# EasyEDA Pro project MN42_v2.eprj, board btnBRD
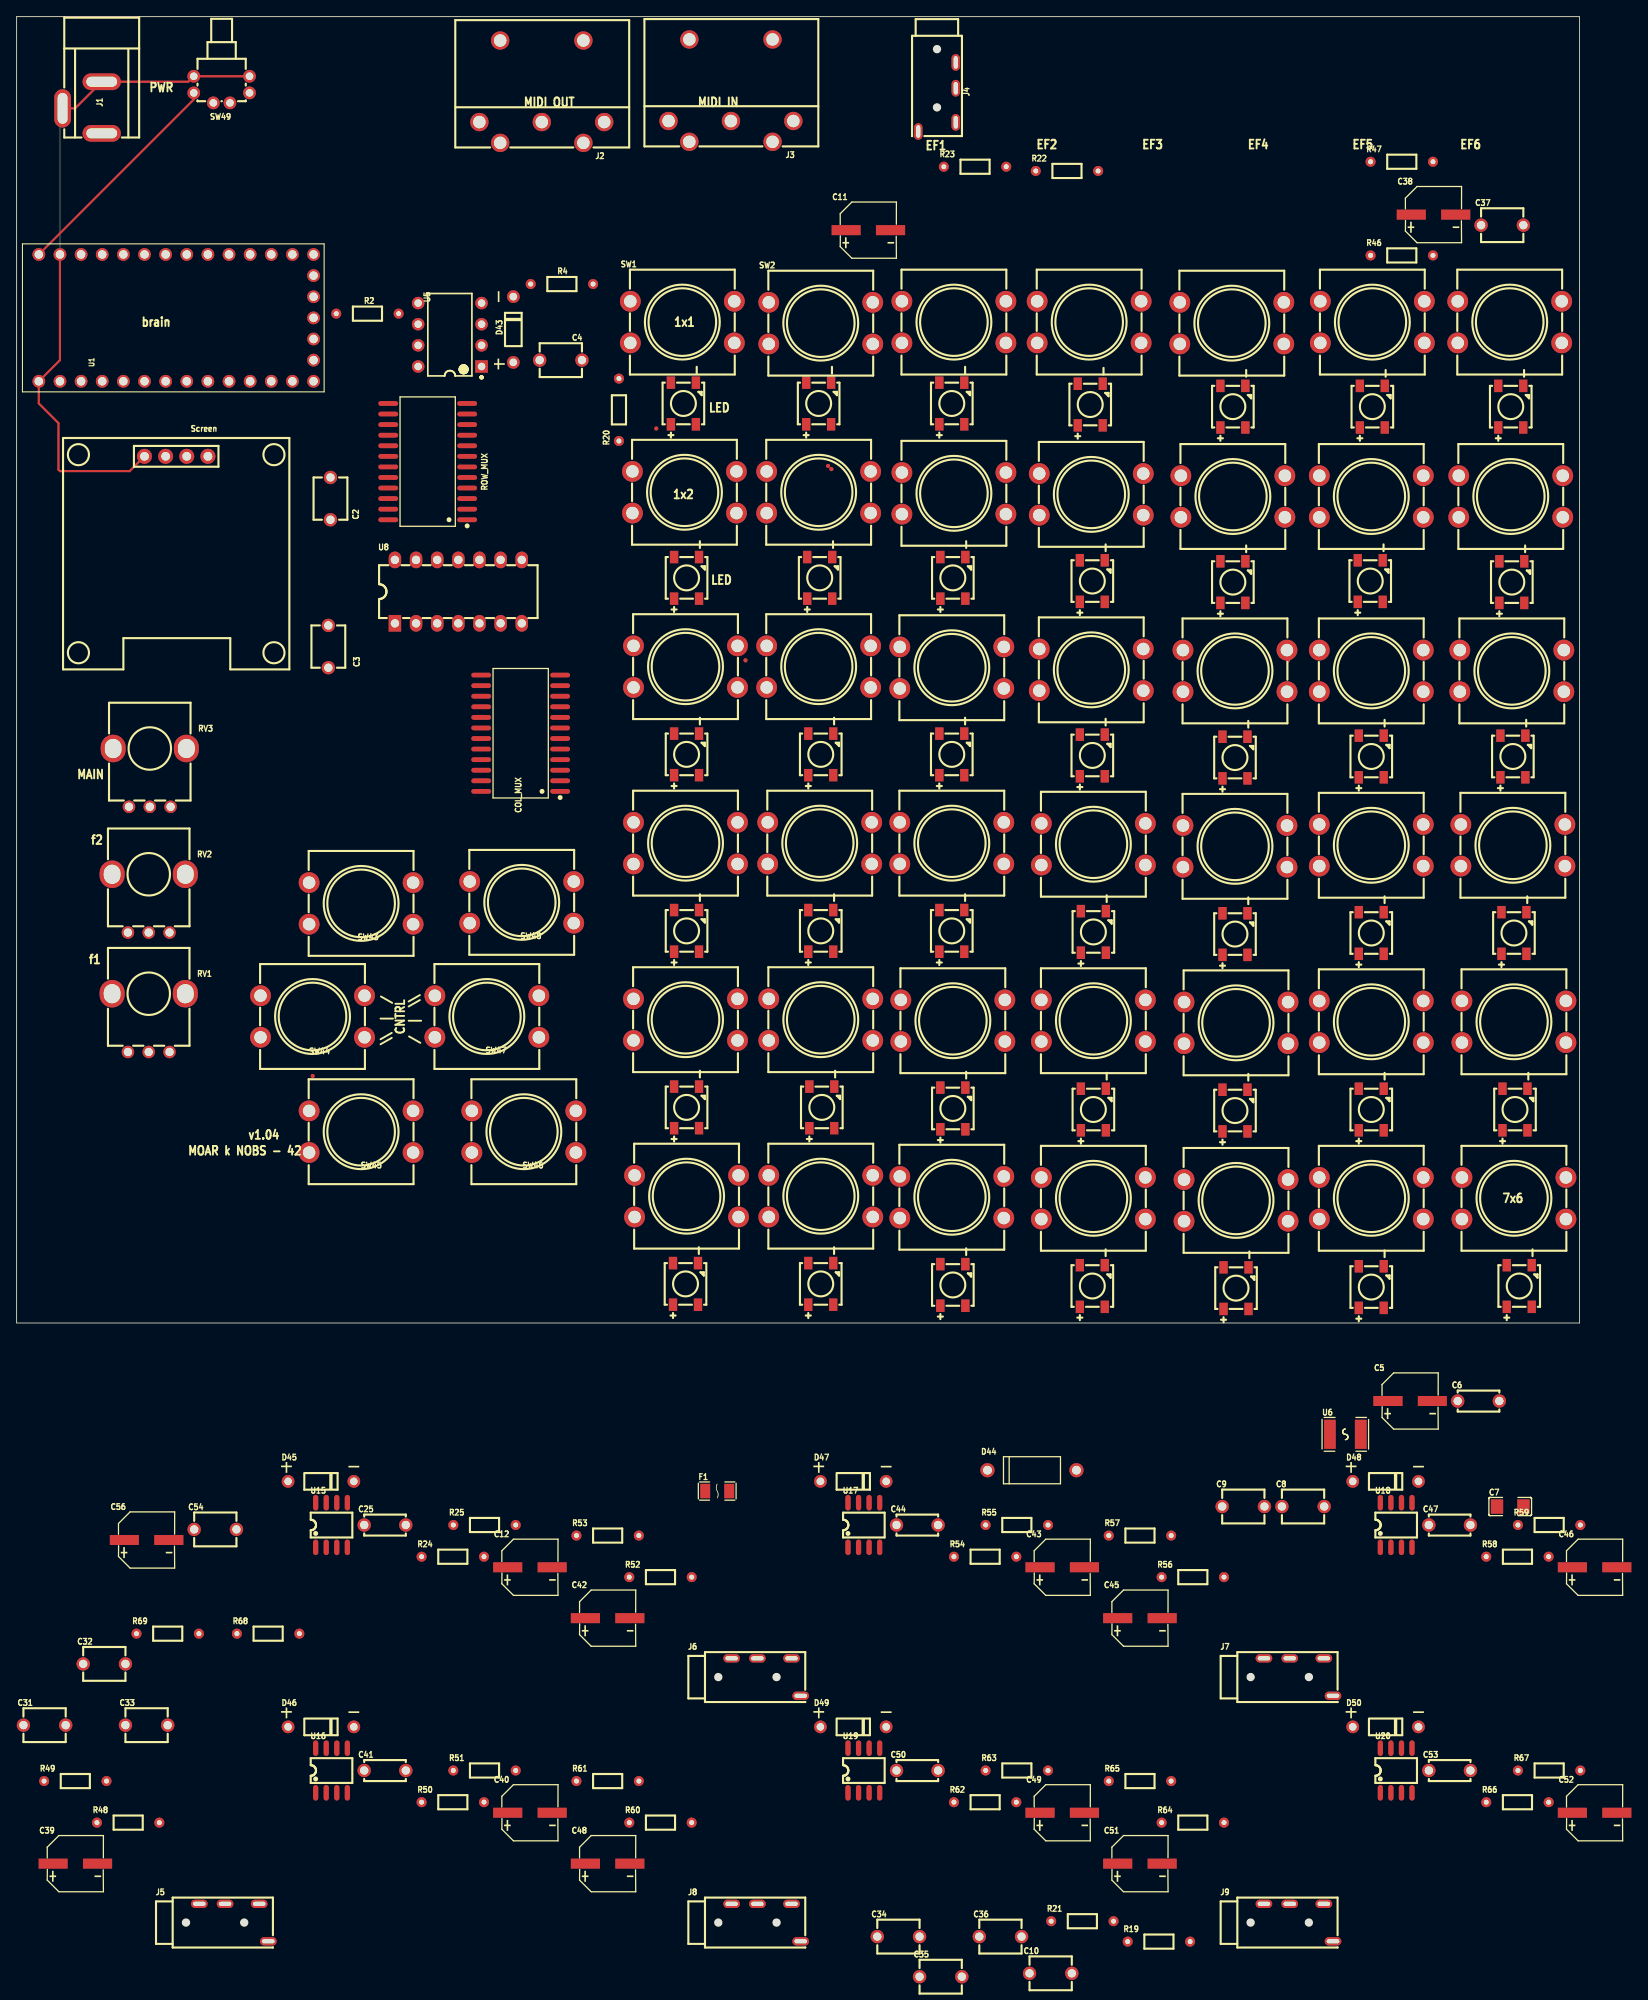
[diagram p3: board, top side]
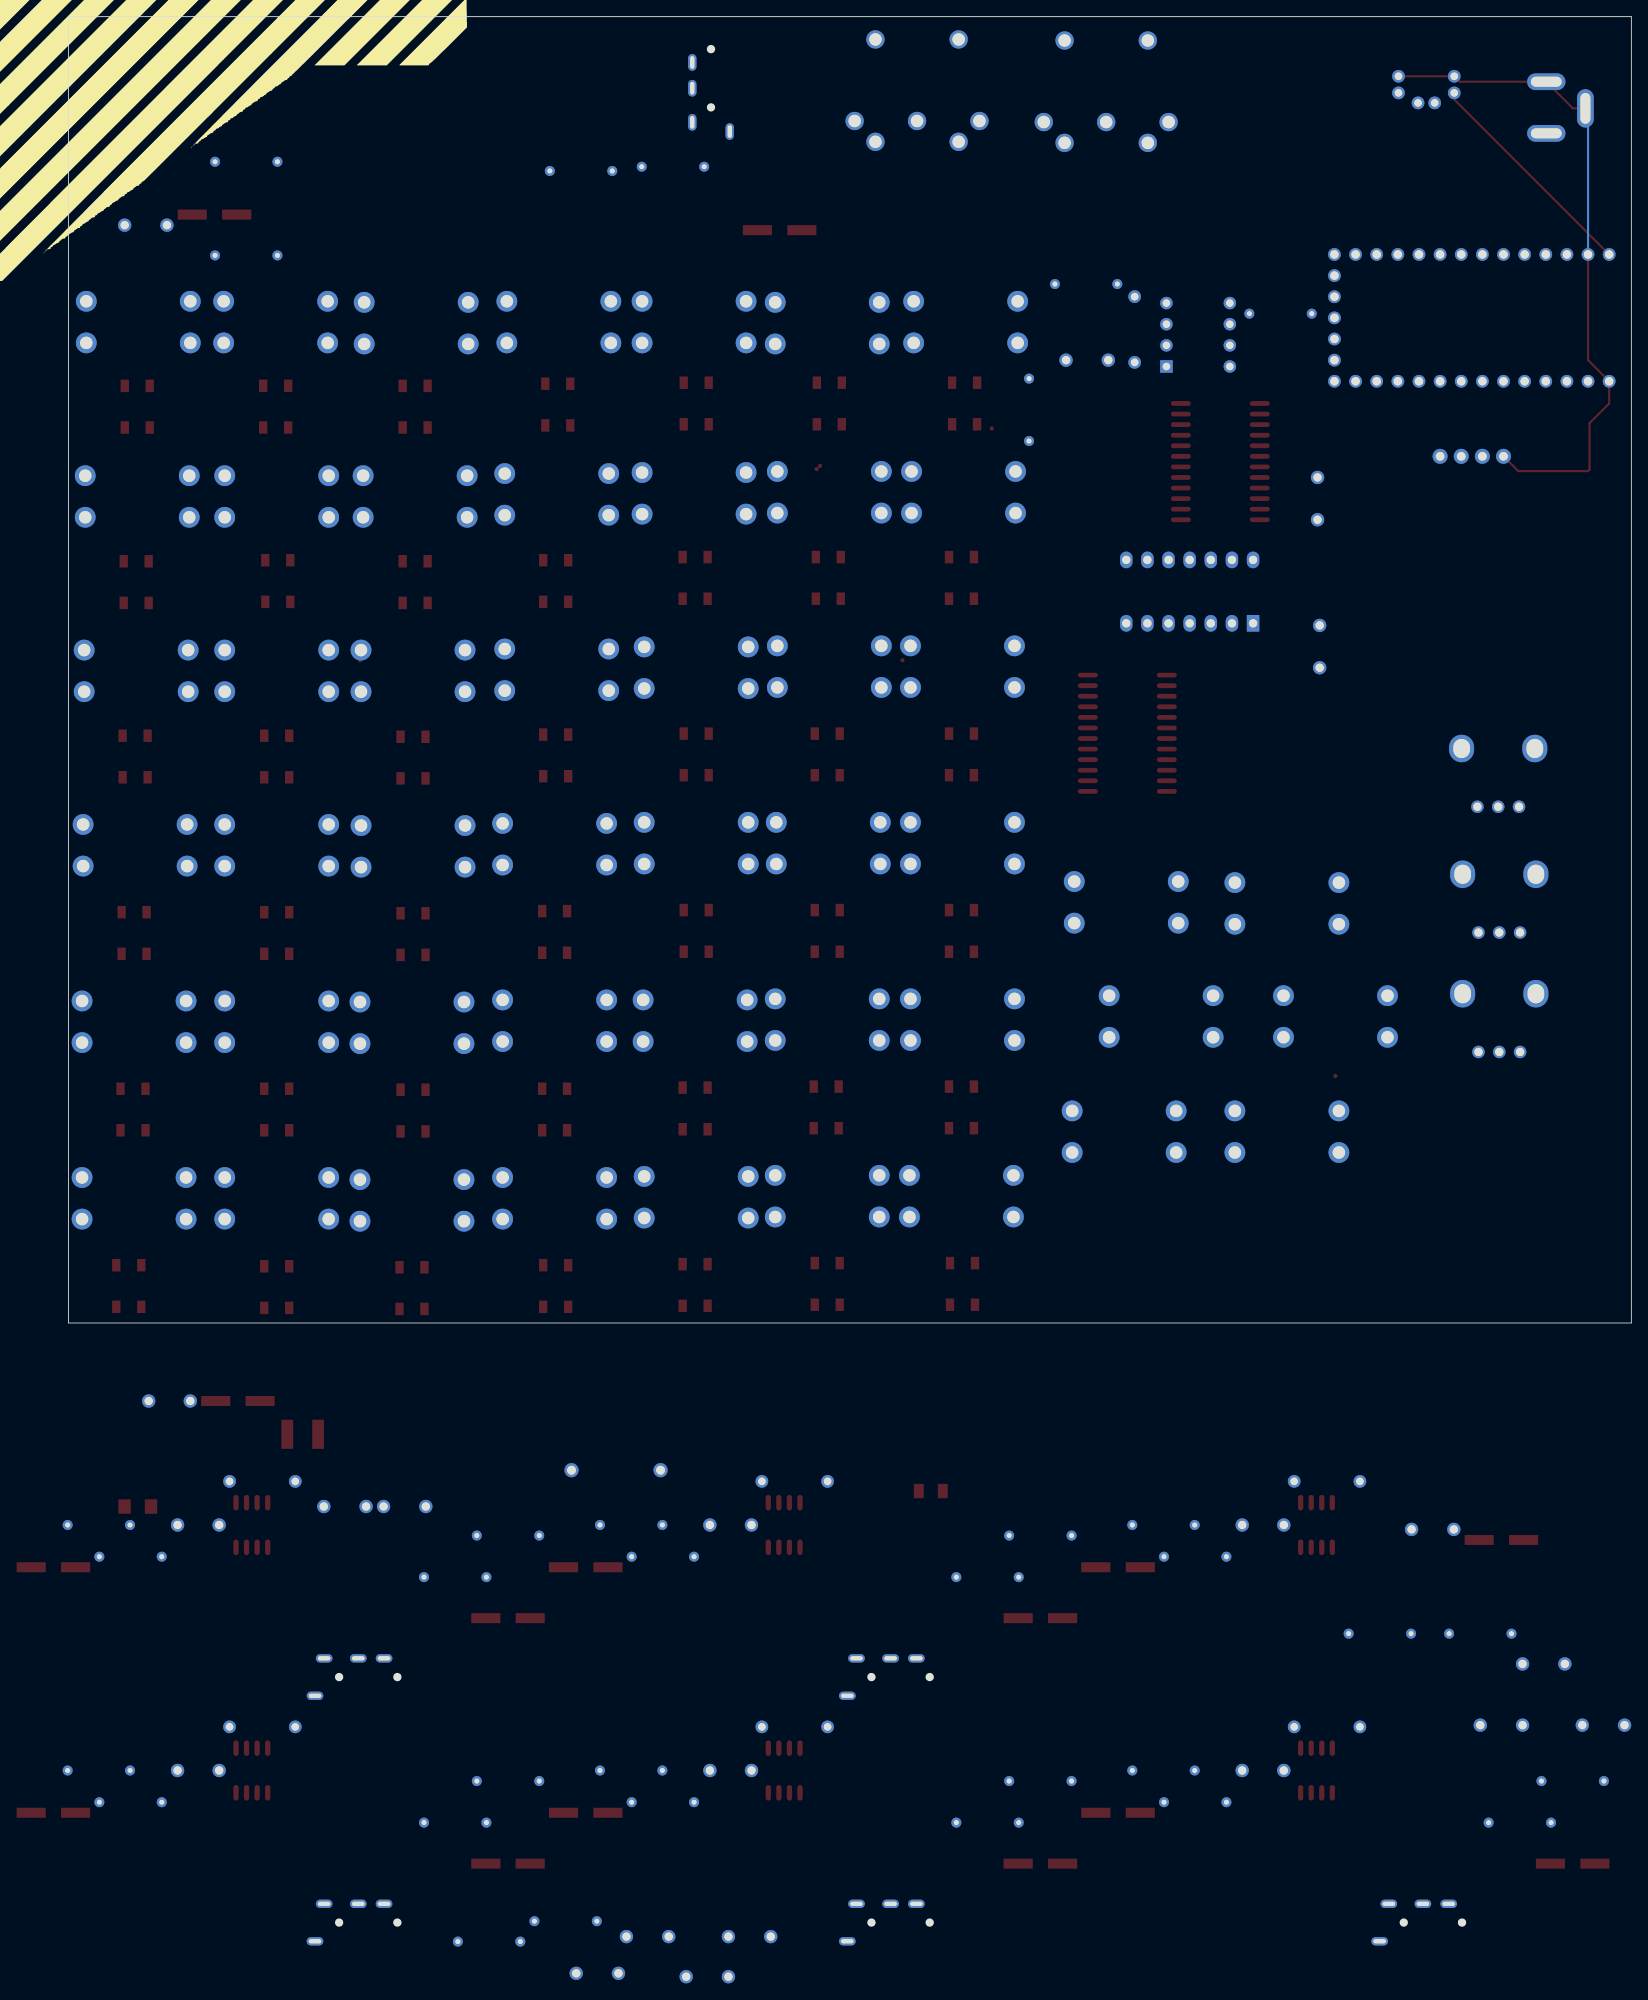
[diagram p4: board, bottom side, seen from below]

Outline 187.83 x 229.51 mm; copper layers: Top Layer, Bottom Layer. Coordinates in mm from the lower left corner of the outline.
Outline path: 0,229.51 0,72.54 187.83,72.54 187.83,229.51 0,229.51
Stack: Top Layer 0.035mm / Dielectric1 1.51mm FR4 er 4.5 / Bottom Layer 0.035mm

## Design rules (mm)
spacing safeClearance (default): track to track 0.152, other pairs 0.152 to 0.3
track width trackWidth (default): min 0.127, default 0.254, max 2.54
differential pair differentialPair (default): width min 0.127, default 0.254, max 2.54; gap min 0.152, default 0.152
via viaSize (default): diameter min 0.5, default 0.61, max 10; hole min 0.3, default 0.305, max 6

## Placement (name value [footprint] x y rotation side)
C2  100nF  [CAP-TH_L5.0-W4.0-P5.00-D1.0]  37.72 171.6 270 top
C3  100nF  [CAP-TH_L5.0-W4.0-P5.00-D1.0]  37.47 153.82 90 top
C4  100nF  [CAP-TH_L5.0-W4.0-P5.00-D1.0]  65.41 188.24 0 top
C5  220uF  [CAP-SMD_BD6.3-L6.6-W6.6-FD]  167.48 63.17 0 top
C6  100nF  [CAP-TH_L5.0-W2.5-P5.00-D1.0]  175.7 63.17 0 top
C7  100uF  [C1206]  179.51 50.49 0 top
C8  1uF  [CAP-TH_L5.0-W4.0-P5.00-D1.0]  154.61 50.49 0 top
C9  100nF  [CAP-TH_L5.0-W4.0-P5.00-D1.0]  147.43 50.49 0 top
C10  100nF  [CAP-TH_L5.0-W4.0-P5.00-D1.0]  124.28 -5.6 0 top
C11  1uF  [CAP-SMD_BD6.3-L6.6-W6.6-FD]  102.36 203.86 0 top
C12  1uF  [CAP-SMD_BD6.3-L6.6-W6.6-FD]  61.69 43.19 0 top
C25  100nF  [CAP-TH_L5.0-W2.5-P5.00-D1.0]  44.27 48.27 0 top
C31  100nF  [CAP-TH_L5.0-W4.0-P5.00-D1.0]  3.36 24.22 0 top
C32  100nF  [CAP-TH_L5.0-W4.0-P5.00-D1.0]  10.54 31.57 0 top
C33  100nF  [CAP-TH_L5.0-W4.0-P5.00-D1.0]  15.62 24.22 0 top
C34  100nF  [CAP-TH_L5.0-W4.0-P5.00-D1.0]  105.98 -1.19 0 top
C35  100nF  [CAP-TH_L5.0-W4.0-P5.00-D1.0]  111.06 -6.01 0 top
C36  100nF  [CAP-TH_L5.0-W4.0-P5.00-D1.0]  118.24 -1.19 0 top
C37  100nF  [CAP-TH_L5.0-W4.0-P5.00-D1.0]  178.55 204.45 0 top
C38  4.7uF  [CAP-SMD_BD6.3-L6.6-W6.6-FD]  170.29 205.72 0 top
C39  1uF  [CAP-SMD_BD6.3-L6.6-W6.6-FD]  7.05 7.57 0 top
C40  1uF  [CAP-SMD_BD6.3-L6.6-W6.6-FD]  61.69 13.69 0 top
C41  100nF  [CAP-TH_L5.0-W2.5-P5.00-D1.0]  44.27 18.77 0 top
C42  1uF  [CAP-SMD_BD6.3-L6.6-W6.6-FD]  71.03 37.07 0 top
C43  1uF  [CAP-SMD_BD6.3-L6.6-W6.6-FD]  125.67 43.19 0 top
C44  100nF  [CAP-TH_L5.0-W2.5-P5.00-D1.0]  108.25 48.27 0 top
C45  1uF  [CAP-SMD_BD6.3-L6.6-W6.6-FD]  135.01 37.07 0 top
C46  1uF  [CAP-SMD_BD6.3-L6.6-W6.6-FD]  189.65 43.19 0 top
C47  100nF  [CAP-TH_L5.0-W2.5-P5.00-D1.0]  172.23 48.27 0 top
C48  1uF  [CAP-SMD_BD6.3-L6.6-W6.6-FD]  71.03 7.57 0 top
C49  1uF  [CAP-SMD_BD6.3-L6.6-W6.6-FD]  125.67 13.69 0 top
C50  100nF  [CAP-TH_L5.0-W2.5-P5.00-D1.0]  108.25 18.77 0 top
C51  1uF  [CAP-SMD_BD6.3-L6.6-W6.6-FD]  135.01 7.57 0 top
C52  1uF  [CAP-SMD_BD6.3-L6.6-W6.6-FD]  189.65 13.69 0 top
C53  100nF  [CAP-TH_L5.0-W2.5-P5.00-D1.0]  172.23 18.77 0 top
C54  1uF  [CAP-TH_L5.0-W4.0-P5.00-D1.0]  23.88 47.74 0 top
C56  10uF  [CAP-SMD_BD6.3-L6.6-W6.6-FD]  15.62 46.47 0 top
COL_MUX  CD74HC4067M96  [SOIC-24_L15.4-W7.5-P1.27-LS10.3-BL]  60.58 143.4 90 top
D1  XL-5050RGBC-WS2812B  [LED-SMD_4P-L5.0-W5.0-BL_XL-5050RGBC]  80.14 183.03 0 top
D2  XL-5050RGBC-WS2812B  [LED-SMD_4P-L5.0-W5.0-BL_XL-5050RGBC]  96.39 183.03 0 top
D3  XL-5050RGBC-WS2812B  [LED-SMD_4P-L5.0-W5.0-BL_XL-5050RGBC]  112.4 183.03 0 top
D4  XL-5050RGBC-WS2812B  [LED-SMD_4P-L5.0-W5.0-BL_XL-5050RGBC]  129.03 182.9 0 top
D5  XL-5050RGBC-WS2812B  [LED-SMD_4P-L5.0-W5.0-BL_XL-5050RGBC]  146.18 182.65 0 top
D6  XL-5050RGBC-WS2812B  [LED-SMD_4P-L5.0-W5.0-BL_XL-5050RGBC]  162.94 182.65 0 top
D7  XL-5050RGBC-WS2812B  [LED-SMD_4P-L5.0-W5.0-BL_XL-5050RGBC]  179.58 182.65 0 top
D8  XL-5050RGBC-WS2812B  [LED-SMD_4P-L5.0-W5.0-BL_XL-5050RGBC]  80.52 162.07 0 top
D9  XL-5050RGBC-WS2812B  [LED-SMD_4P-L5.0-W5.0-BL_XL-5050RGBC]  96.52 162.07 0 top
D10  XL-5050RGBC-WS2812B  [LED-SMD_4P-L5.0-W5.0-BL_XL-5050RGBC]  112.52 162.07 0 top
D11  XL-5050RGBC-WS2812B  [LED-SMD_4P-L5.0-W5.0-BL_XL-5050RGBC]  129.29 161.69 0 top
D12  XL-5050RGBC-WS2812B  [LED-SMD_4P-L5.0-W5.0-BL_XL-5050RGBC]  146.18 161.57 0 top
D13  XL-5050RGBC-WS2812B  [LED-SMD_4P-L5.0-W5.0-BL_XL-5050RGBC]  162.69 161.69 0 top
D14  XL-5050RGBC-WS2812B  [LED-SMD_4P-L5.0-W5.0-BL_XL-5050RGBC]  179.71 161.57 0 top
D15  XL-5050RGBC-WS2812B  [LED-SMD_4P-L5.0-W5.0-BL_XL-5050RGBC]  80.52 140.86 0 top
D16  XL-5050RGBC-WS2812B  [LED-SMD_4P-L5.0-W5.0-BL_XL-5050RGBC]  96.65 140.86 0 top
D17  XL-5050RGBC-WS2812B  [LED-SMD_4P-L5.0-W5.0-BL_XL-5050RGBC]  112.4 140.86 0 top
D18  XL-5050RGBC-WS2812B  [LED-SMD_4P-L5.0-W5.0-BL_XL-5050RGBC]  129.29 140.74 0 top
D19  XL-5050RGBC-WS2812B  [LED-SMD_4P-L5.0-W5.0-BL_XL-5050RGBC]  146.43 140.48 0 top
D20  XL-5050RGBC-WS2812B  [LED-SMD_4P-L5.0-W5.0-BL_XL-5050RGBC]  162.81 140.61 0 top
D21  XL-5050RGBC-WS2812B  [LED-SMD_4P-L5.0-W5.0-BL_XL-5050RGBC]  179.83 140.61 0 top
D22  XL-5050RGBC-WS2812B  [LED-SMD_4P-L5.0-W5.0-BL_XL-5050RGBC]  80.52 119.66 0 top
D23  XL-5050RGBC-WS2812B  [LED-SMD_4P-L5.0-W5.0-BL_XL-5050RGBC]  96.65 119.66 0 top
D24  XL-5050RGBC-WS2812B  [LED-SMD_4P-L5.0-W5.0-BL_XL-5050RGBC]  112.4 119.66 0 top
D25  XL-5050RGBC-WS2812B  [LED-SMD_4P-L5.0-W5.0-BL_XL-5050RGBC]  129.41 119.53 0 top
D26  XL-5050RGBC-WS2812B  [LED-SMD_4P-L5.0-W5.0-BL_XL-5050RGBC]  146.43 119.27 0 top
D27  XL-5050RGBC-WS2812B  [LED-SMD_4P-L5.0-W5.0-BL_XL-5050RGBC]  162.81 119.4 0 top
D28  XL-5050RGBC-WS2812B  [LED-SMD_4P-L5.0-W5.0-BL_XL-5050RGBC]  179.96 119.4 0 top
D29  XL-5050RGBC-WS2812B  [LED-SMD_4P-L5.0-W5.0-BL_XL-5050RGBC]  80.52 98.45 0 top
D30  XL-5050RGBC-WS2812B  [LED-SMD_4P-L5.0-W5.0-BL_XL-5050RGBC]  96.77 98.45 0 top
D31  XL-5050RGBC-WS2812B  [LED-SMD_4P-L5.0-W5.0-BL_XL-5050RGBC]  112.52 98.32 0 top
D32  XL-5050RGBC-WS2812B  [LED-SMD_4P-L5.0-W5.0-BL_XL-5050RGBC]  129.41 98.19 0 top
D33  XL-5050RGBC-WS2812B  [LED-SMD_4P-L5.0-W5.0-BL_XL-5050RGBC]  146.43 98.07 0 top
D34  XL-5050RGBC-WS2812B  [LED-SMD_4P-L5.0-W5.0-BL_XL-5050RGBC]  162.81 98.19 0 top
D35  XL-5050RGBC-WS2812B  [LED-SMD_4P-L5.0-W5.0-BL_XL-5050RGBC]  180.09 98.19 0 top
D36  XL-5050RGBC-WS2812B  [LED-SMD_4P-L5.0-W5.0-BL_XL-5050RGBC]  80.39 77.24 0 top
D37  XL-5050RGBC-WS2812B  [LED-SMD_4P-L5.0-W5.0-BL_XL-5050RGBC]  96.65 77.24 0 top
D38  XL-5050RGBC-WS2812B  [LED-SMD_4P-L5.0-W5.0-BL_XL-5050RGBC]  112.52 77.11 0 top
D39  XL-5050RGBC-WS2812B  [LED-SMD_4P-L5.0-W5.0-BL_XL-5050RGBC]  129.29 76.98 0 top
D40  XL-5050RGBC-WS2812B  [LED-SMD_4P-L5.0-W5.0-BL_XL-5050RGBC]  146.56 76.73 0 top
D41  XL-5050RGBC-WS2812B  [LED-SMD_4P-L5.0-W5.0-BL_XL-5050RGBC]  162.81 76.86 0 top
D42  XL-5050RGBC-WS2812B  [LED-SMD_4P-L5.0-W5.0-BL_XL-5050RGBC]  180.59 76.98 0 top
D43  1N4148PF  [DO-35_BD1.9-L3.9-P7.90-D0.5-FD]  59.7 191.92 90 top
D44  SA6.0A  [DO-15_BD3.1-L6.7-P10.70-D0.8-RD]  122.03 54.85 0 top
D45  1N4148PF  [DO-35_BD1.9-L3.9-P7.90-D0.5-FD]  36.58 53.51 0 top
D46  1N4148PF  [DO-35_BD1.9-L3.9-P7.90-D0.5-FD]  36.58 24.01 0 top
D47  1N4148PF  [DO-35_BD1.9-L3.9-P7.90-D0.5-FD]  100.56 53.51 0 top
D48  1N4148PF  [DO-35_BD1.9-L3.9-P7.90-D0.5-FD]  164.53 53.51 0 top
D49  1N4148PF  [DO-35_BD1.9-L3.9-P7.90-D0.5-FD]  100.56 24.01 0 top
D50  1N4148PF  [DO-35_BD1.9-L3.9-P7.90-D0.5-FD]  164.53 24.01 0 top
F1  nSMD050-33V  [F1206]  84.2 52.35 0 top
J1  DC005  [DC-IN-TH_DC005]  7.87 218.59 270 top
J2  DIN-504B-M10  [CONN-TH_DIN-504B-M10]  63.12 220.49 180 top
J3  DIN-504B-M10  [CONN-TH_DIN-504B-M10]  85.85 220.62 180 top
J4  HC-PJ-320A  [AUDIO-SMD_HC-PJ-320A]  110.62 219.86 270 top
J5  HC-PJ-320A  [AUDIO-SMD_HC-PJ-320A]  26.1 0.5 0 top
J6  HC-PJ-320A  [AUDIO-SMD_HC-PJ-320A]  90.08 29.99 0 top
J7  HC-PJ-320A  [AUDIO-SMD_HC-PJ-320A]  154.06 29.99 0 top
J8  HC-PJ-320A  [AUDIO-SMD_HC-PJ-320A]  90.08 0.5 0 top
J9  HC-PJ-320A  [AUDIO-SMD_HC-PJ-320A]  154.06 0.5 0 top
R2  4.7kΩ  [RES-TH_BD1.7-L3.5-P7.50-D0.5]  42.16 193.82 0 top
R4  220Ω  [RES-TH_BD1.7-L3.5-P7.50-D0.5]  65.53 197.38 0 top
R19  220Ω  [RES-TH_BD1.7-L3.5-P7.50-D0.5]  137.29 -1.79 0 top
R20  33Ω  [RES-TH_BD1.7-L3.5-P7.50-D0.5]  72.39 182.27 90 top
R21  220Ω  [RES-TH_BD1.7-L3.5-P7.50-D0.5]  128.09 0.66 0 top
R22  100kΩ  [RES-TH_BD1.7-L3.5-P7.50-D0.5]  126.24 210.97 0 top
R23  10kΩ  [RES-TH_BD1.7-L3.5-P7.50-D0.5]  115.19 211.48 0 top
R24  20kΩ  [RES-TH_BD1.7-L3.5-P7.50-D0.5]  52.42 44.46 0 top
R25  4.7kΩ  [RES-TH_BD1.7-L3.5-P7.50-D0.5]  56.23 48.27 0 top
R46  100kΩ  [RES-TH_BD1.7-L3.5-P7.50-D0.5]  166.48 200.82 0 top
R47  100kΩ  [RES-TH_BD1.7-L3.5-P7.50-D0.5]  166.48 212.07 0 top
R48  100kΩ  [RES-TH_BD1.7-L3.5-P7.50-D0.5]  13.4 12.5 0 top
R49  10kΩ  [RES-TH_BD1.7-L3.5-P7.50-D0.5]  7.05 17.5 0 top
R50  20kΩ  [RES-TH_BD1.7-L3.5-P7.50-D0.5]  52.42 14.96 0 top
R51  4.7kΩ  [RES-TH_BD1.7-L3.5-P7.50-D0.5]  56.23 18.77 0 top
R52  100kΩ  [RES-TH_BD1.7-L3.5-P7.50-D0.5]  77.38 42 0 top
R53  10kΩ  [RES-TH_BD1.7-L3.5-P7.50-D0.5]  71.03 47 0 top
R54  20kΩ  [RES-TH_BD1.7-L3.5-P7.50-D0.5]  116.4 44.46 0 top
R55  4.7kΩ  [RES-TH_BD1.7-L3.5-P7.50-D0.5]  120.21 48.27 0 top
R56  100kΩ  [RES-TH_BD1.7-L3.5-P7.50-D0.5]  141.36 42 0 top
R57  10kΩ  [RES-TH_BD1.7-L3.5-P7.50-D0.5]  135.01 47 0 top
R58  20kΩ  [RES-TH_BD1.7-L3.5-P7.50-D0.5]  180.38 44.46 0 top
R59  4.7kΩ  [RES-TH_BD1.7-L3.5-P7.50-D0.5]  184.19 48.27 0 top
R60  100kΩ  [RES-TH_BD1.7-L3.5-P7.50-D0.5]  77.38 12.5 0 top
R61  10kΩ  [RES-TH_BD1.7-L3.5-P7.50-D0.5]  71.03 17.5 0 top
R62  20kΩ  [RES-TH_BD1.7-L3.5-P7.50-D0.5]  116.4 14.96 0 top
R63  4.7kΩ  [RES-TH_BD1.7-L3.5-P7.50-D0.5]  120.21 18.77 0 top
R64  100kΩ  [RES-TH_BD1.7-L3.5-P7.50-D0.5]  141.36 12.5 0 top
R65  10kΩ  [RES-TH_BD1.7-L3.5-P7.50-D0.5]  135.01 17.5 0 top
R66  20kΩ  [RES-TH_BD1.7-L3.5-P7.50-D0.5]  180.38 14.96 0 top
R67  4.7kΩ  [RES-TH_BD1.7-L3.5-P7.50-D0.5]  184.19 18.77 0 top
R68  4.7kΩ  [RES-TH_BD1.7-L3.5-P7.50-D0.5]  30.23 35.21 0 top
R69  4.7kΩ  [RES-TH_BD1.7-L3.5-P7.50-D0.5]  18.16 35.21 0 top
ROW_MUX  CD74HC4067M96  [SOIC-24_L15.4-W7.5-P1.27-LS10.3-BL]  49.4 176.04 90 top
RV1  10kΩ  [RES-ADJ-TH_RK09K1130A5R]  15.88 108.61 0 top
RV2  10kΩ  [RES-ADJ-TH_RK09K1130A5R]  15.88 122.96 0 top
RV3  10kΩ  [RES-ADJ-TH_RK09K1130A5R]  16 138.07 0 top
Screen  HS96L03W2C03  [OLED-TH_L27.8-W27.2-P2.54_C9900033791]  19.18 176.68 0 top
SW1  HX B3F-4055-Y  [SW-TH_4P-L12.0-W12.0-P5.00-LS12.5]  80.01 192.81 0 top
SW2  HX B3F-4055-Y  [SW-TH_4P-L12.0-W12.0-P5.00-LS12.5]  96.65 192.68 0 top
SW3  HX B3F-4055-Y  [SW-TH_4P-L12.0-W12.0-P5.00-LS12.5]  112.65 192.81 180 top
SW4  HX B3F-4055-Y  [SW-TH_4P-L12.0-W12.0-P5.00-LS12.5]  128.91 192.81 180 top
SW5  HX B3F-4055-Y  [SW-TH_4P-L12.0-W12.0-P5.00-LS12.5]  146.05 192.68 180 top
SW6  HX B3F-4055-Y  [SW-TH_4P-L12.0-W12.0-P5.00-LS12.5]  162.94 192.81 180 top
SW7  HX B3F-4055-Y  [SW-TH_4P-L12.0-W12.0-P5.00-LS12.5]  179.45 192.81 180 top
SW8  HX B3F-4055-Y  [SW-TH_4P-L12.0-W12.0-P5.00-LS12.5]  80.26 172.36 180 top
SW9  HX B3F-4055-Y  [SW-TH_4P-L12.0-W12.0-P5.00-LS12.5]  96.39 172.36 180 top
SW10  HX B3F-4055-Y  [SW-TH_4P-L12.0-W12.0-P5.00-LS12.5]  112.65 172.23 180 top
SW11  HX B3F-4055-Y  [SW-TH_4P-L12.0-W12.0-P5.00-LS12.5]  129.16 172.11 180 top
SW12  HX B3F-4055-Y  [SW-TH_4P-L12.0-W12.0-P5.00-LS12.5]  146.18 171.85 180 top
SW13  HX B3F-4055-Y  [SW-TH_4P-L12.0-W12.0-P5.00-LS12.5]  162.81 171.85 180 top
SW14  HX B3F-4055-Y  [SW-TH_4P-L12.0-W12.0-P5.00-LS12.5]  179.58 171.85 180 top
SW15  HX B3F-4055-Y  [SW-TH_4P-L12.0-W12.0-P5.00-LS12.5]  80.39 151.41 180 top
SW16  HX B3F-4055-Y  [SW-TH_4P-L12.0-W12.0-P5.00-LS12.5]  96.39 151.41 180 top
SW17  HX B3F-4055-Y  [SW-TH_4P-L12.0-W12.0-P5.00-LS12.5]  112.4 151.28 180 top
SW18  HX B3F-4055-Y  [SW-TH_4P-L12.0-W12.0-P5.00-LS12.5]  129.16 151.02 180 top
SW19  HX B3F-4055-Y  [SW-TH_4P-L12.0-W12.0-P5.00-LS12.5]  146.43 150.9 180 top
SW20  HX B3F-4055-Y  [SW-TH_4P-L12.0-W12.0-P5.00-LS12.5]  162.81 150.9 180 top
SW21  HX B3F-4055-Y  [SW-TH_4P-L12.0-W12.0-P5.00-LS12.5]  179.71 150.9 180 top
SW22  HX B3F-4055-Y  [SW-TH_4P-L12.0-W12.0-P5.00-LS12.5]  80.39 130.2 180 top
SW23  HX B3F-4055-Y  [SW-TH_4P-L12.0-W12.0-P5.00-LS12.5]  96.52 130.2 180 top
SW24  HX B3F-4055-Y  [SW-TH_4P-L12.0-W12.0-P5.00-LS12.5]  112.4 130.2 180 top
SW25  HX B3F-4055-Y  [SW-TH_4P-L12.0-W12.0-P5.00-LS12.5]  129.41 130.07 180 top
SW26  HX B3F-4055-Y  [SW-TH_4P-L12.0-W12.0-P5.00-LS12.5]  146.43 129.82 180 top
SW27  HX B3F-4055-Y  [SW-TH_4P-L12.0-W12.0-P5.00-LS12.5]  162.81 129.94 180 top
SW28  HX B3F-4055-Y  [SW-TH_4P-L12.0-W12.0-P5.00-LS12.5]  179.83 129.94 180 top
SW29  HX B3F-4055-Y  [SW-TH_4P-L12.0-W12.0-P5.00-LS12.5]  80.39 108.99 180 top
SW30  HX B3F-4055-Y  [SW-TH_4P-L12.0-W12.0-P5.00-LS12.5]  96.65 108.99 180 top
SW31  HX B3F-4055-Y  [SW-TH_4P-L12.0-W12.0-P5.00-LS12.5]  112.52 108.86 180 top
SW32  HX B3F-4055-Y  [SW-TH_4P-L12.0-W12.0-P5.00-LS12.5]  129.41 108.86 180 top
SW33  HX B3F-4055-Y  [SW-TH_4P-L12.0-W12.0-P5.00-LS12.5]  146.56 108.61 180 top
SW34  HX B3F-4055-Y  [SW-TH_4P-L12.0-W12.0-P5.00-LS12.5]  162.81 108.73 180 top
SW35  HX B3F-4055-Y  [SW-TH_4P-L12.0-W12.0-P5.00-LS12.5]  179.96 108.73 180 top
SW36  HX B3F-4055-Y  [SW-TH_4P-L12.0-W12.0-P5.00-LS12.5]  80.52 87.78 180 top
SW37  HX B3F-4055-Y  [SW-TH_4P-L12.0-W12.0-P5.00-LS12.5]  96.65 87.78 180 top
SW38  HX B3F-4055-Y  [SW-TH_4P-L12.0-W12.0-P5.00-LS12.5]  112.4 87.65 180 top
SW39  HX B3F-4055-Y  [SW-TH_4P-L12.0-W12.0-P5.00-LS12.5]  129.41 87.52 180 top
SW40  HX B3F-4055-Y  [SW-TH_4P-L12.0-W12.0-P5.00-LS12.5]  146.56 87.27 180 top
SW41  HX B3F-4055-Y  [SW-TH_4P-L12.0-W12.0-P5.00-LS12.5]  162.81 87.52 180 top
SW42  HX B3F-4055-Y  [SW-TH_4P-L12.0-W12.0-P5.00-LS12.5]  179.96 87.52 180 top
SW43  HX B3F-4055-Y  [SW-TH_4P-L12.0-W12.0-P5.00-LS12.5]  41.4 122.96 180 top
SW44  HX B3F-4055-Y  [SW-TH_4P-L12.0-W12.0-P5.00-LS12.5]  35.56 109.37 180 top
SW45  HX B3F-4055-Y  [SW-TH_4P-L12.0-W12.0-P5.00-LS12.5]  41.4 95.53 180 top
SW46  HX B3F-4055-Y  [SW-TH_4P-L12.0-W12.0-P5.00-LS12.5]  60.96 95.53 180 top
SW47  HX B3F-4055-Y  [SW-TH_4P-L12.0-W12.0-P5.00-LS12.5]  56.52 109.37 180 top
SW48  HX B3F-4055-Y  [SW-TH_4P-L12.0-W12.0-P5.00-LS12.5]  60.71 123.08 180 top
SW49  TK-6580A-1  [SW-TH_TK-6580A-1]  24.64 220.75 180 top
U1  Teensy  [teensy 4.0:MODULE_DEV-15583]  19.18 193.32 90 top
U5  6N138  [DIP-8_L9.8-W6.6-P2.54-LS7.6-BL]  52.07 191.28 90 top
U6  1812L200/33GR  [F1812]  159.69 59.16 0 top
U8  SN74AHCT125N  [PDIP-14_L19.3-W6.4-P2.54-LS7.6-BL]  53.09 160.42 0 top
U15  MCP6002DRG  [SOP-8_L4.9-W3.9-P1.27-LS6.0-BL]  37.85 48.27 0 top
U16  MCP6002DRG  [SOP-8_L4.9-W3.9-P1.27-LS6.0-BL]  37.85 18.77 0 top
U17  MCP6002DRG  [SOP-8_L4.9-W3.9-P1.27-LS6.0-BL]  101.82 48.27 0 top
U18  MCP6002DRG  [SOP-8_L4.9-W3.9-P1.27-LS6.0-BL]  165.81 48.27 0 top
U19  MCP6002DRG  [SOP-8_L4.9-W3.9-P1.27-LS6.0-BL]  101.82 18.77 0 top
U20  MCP6002DRG  [SOP-8_L4.9-W3.9-P1.27-LS6.0-BL]  165.81 18.77 0 top

## Footprints (pads in the part's own frame, mm; a bottom-side part is the same pattern mirrored in y, then rotated)
AUDIO-SMD_HC-PJ-320A
  oval 2x1 hole 1.5x0.5: 1(4.15,-2.25) 2(-4.15,2.25) 3(-1.05,2.25) 4(3.05,2.25)
C1206
  rect 1.485x1.728 smd: 1(-1.593,0) 2(1.593,0)
CAP-SMD_BD6.3-L6.6-W6.6-FD
  rect 3.5x1.2 smd: 1(-2.67,0) 2(2.67,0)
CAP-TH_L5.0-W2.5-P5.00-D1.0
  round 1.6 hole 1: 1(-2.5,0) 2(2.5,0)
CAP-TH_L5.0-W4.0-P5.00-D1.0
  round 1.6 hole 1: 1(-2.54,0) 2(2.54,0)
CONN-TH_DIN-504B-M10
  round 2.2 hole 1.5: 1(-7.5,3.65) 2(-5,6.15) 3(0,3.65) 4(5,6.15) 5(7.5,3.65) 6(-5,-6.15) 7(5,-6.15)
DC-IN-TH_DC005
  oval 2x4.6 hole 1.2x3.7: 1(3.1,2.35) 2(-3.1,2.35)
  oval 4.6x2 hole 3.7x1.2: 3(0.1,-2.35)
DIP-8_L9.8-W6.6-P2.54-LS7.6-BL
  rect 1.5x1.5 hole 0.9: 1(-3.81,-3.81)
  round 1.5 hole 0.9: 2(-1.27,-3.81) 3(1.27,-3.81) 4(3.81,-3.81) 5(3.81,3.81) 6(1.27,3.81) 7(-1.27,3.81) 8(-3.81,3.81)
DO-15_BD3.1-L6.7-P10.70-D0.8-RD
  round 1.7 hole 1.06: 1(-5.35,0) 2(5.35,0)
DO-35_BD1.9-L3.9-P7.90-D0.5-FD
  round 1.524 hole 0.914: 1(-3.95,0) 2(3.95,0)
F1206
  rect 1.19x1.728 smd: 1(-1.445,0) 2(1.445,0)
F1812
  rect 1.407x3.499 smd: 1(-1.853,0) 2(1.853,0)
LED-SMD_4P-L5.0-W5.0-BL_XL-5050RGBC
  rect 1x1.5 smd: 1(-1.5,-2.5) 2(1.5,-2.5) 3(1.5,2.5) 4(-1.5,2.5)
OLED-TH_L27.8-W27.2-P2.54_C9900033791
  round 1.8 hole 1.05: 1(-3.81,0) 2(-1.27,0) 3(1.27,0) 4(3.81,0)
PDIP-14_L19.3-W6.4-P2.54-LS7.6-BL
  rect 1.5x2 hole 1: 1(-7.62,-3.81)
  oval 1.5x2 hole 1: 2(-5.08,-3.81) 3(-2.54,-3.81) 4(0,-3.81) 5(2.54,-3.81) 6(5.08,-3.81) 7(7.62,-3.81) 8(7.62,3.81) 9(5.08,3.81) 10(2.54,3.81) 11(0,3.81) 12(-2.54,3.81) 13(-5.08,3.81) 14(-7.62,3.81)
RES-ADJ-TH_RK09K1130A5R
  round 1.5 hole 1: 1(-2.5,-3.5) 2(0,-3.5) 3(2.5,-3.5)
  oval 3x3.3 hole 2x2.3: 4(4.4,3.5) 5(-4.4,3.5)
RES-TH_BD1.7-L3.5-P7.50-D0.5
  round 1.2 hole 0.6: 1(-3.75,0) 2(3.75,0)
SOIC-24_L15.4-W7.5-P1.27-LS10.3-BL
  oval 0.574x2.388 smd: 1(-6.985,-4.744) 2(-5.715,-4.744) 3(-4.445,-4.744) 4(-3.175,-4.744) 5(-1.905,-4.744) 6(-0.635,-4.744) 7(0.635,-4.744) 8(1.905,-4.744) 9(3.175,-4.744) 10(4.445,-4.744) 11(5.715,-4.744) 12(6.985,-4.744) 13(6.985,4.744) 14(5.715,4.744) 15(4.445,4.744) 16(3.175,4.744) 17(1.905,4.744) 18(0.635,4.744) 19(-0.635,4.744) 20(-1.905,4.744) 21(-3.175,4.744) 22(-4.445,4.744) 23(-5.715,4.744) 24(-6.985,4.744)
SOP-8_L4.9-W3.9-P1.27-LS6.0-BL
  oval 0.63x1.865 smd: 1(-1.905,-2.683) 2(-0.635,-2.683) 3(0.635,-2.683) 4(1.905,-2.683) 5(1.905,2.683) 6(0.635,2.683) 7(-0.635,2.683) 8(-1.905,2.683)
SW-TH_4P-L12.0-W12.0-P5.00-LS12.5
  round 2.5 hole 1.5: 1(-6.25,2.5) 2(6.25,2.5) 3(-6.25,-2.5) 4(6.25,-2.5)
SW-TH_TK-6580A-1
  round 1.524 hole 0.914: 1(3.35,-1.6) 2(3.35,0.4) 3(-3.35,-1.6) 4(-3.35,0.4) 5(1,1.6) 6(-1,1.6)
teensy 4.0:MODULE_DEV-15583
  round 1.53 hole 1.02: 0(-7.62,13.97) 1(-7.62,11.43) 2(-7.62,8.89) 3(-7.62,6.35) 3.3V_1(-2.54,-16.51) 3.3V_2(7.62,11.43) 4(-7.62,3.81) 5(-7.62,1.27) 6(-7.62,-1.27) 7(-7.62,-3.81) 8(-7.62,-6.35) 9(-7.62,-8.89) 10(-7.62,-11.43) 11(-7.62,-13.97) 12(-7.62,-16.51) 13(7.62,-16.51) 14(7.62,-13.97) 15(7.62,-11.43) 16(7.62,-8.89) 17(7.62,-6.35) 18(7.62,-3.81) 19(7.62,-1.27) 20(7.62,1.27) 21(7.62,3.81) 22(7.62,6.35) 23(7.62,8.89) G1(-7.62,16.51) G2(0,-16.51) G3(7.62,13.97) ON-OFF(5.08,-16.51) PGM(2.54,-16.51) VBAT(-5.08,-16.51) VIN(7.62,16.51)

## Nets
As in the schematic.

Pads without a net: D42 2; J2 1 3 6 7; J3 1 3 6 7; SW1 3 4; SW2 3 4; SW3 3 4; SW4 3 4; SW5 3 4; SW6 3 4; SW7 3 4; SW8 3 4; SW9 3 4; SW10 3 4; SW11 3 4; SW12 3 4; SW13 3 4; SW14 3 4; SW15 3 4; SW16 3 4; SW17 3 4; SW18 3 4; SW19 3 4; SW20 3 4; SW21 3 4; SW22 3 4; SW23 3 4; SW24 3 4; SW25 3 4; SW26 3 4; SW27 3 4; SW28 3 4; SW29 3 4; SW30 3 4; SW31 3 4; SW32 3 4; SW33 3 4; SW34 3 4; SW35 3 4; SW36 3 4; SW37 3 4; SW38 3 4; SW39 3 4; SW40 3 4; SW41 3 4; SW42 3 4; SW43 3 4; SW44 3 4; SW45 3 4; SW46 3 4; SW47 3 4; SW48 3 4; U1 12 13 23 ON-OFF PGM VBAT; U5 1 4; U15 5 6 7; U16 5 6 7; U17 5 6 7; U18 5 6 7; U19 5 6 7; U20 5 6 7

## Routing (per net, layer and track width the routed paths; a pad name or vN(x,y) marks a point on that pad's centre or on a via; arc(x,y) is an arc through that point)
GND: length 80.8
  Top Layer w0.254: U1.G3 5.21,188.24 U1.G1 2.67,183.03 5.03,180.67 5.03,175.08 5.21,174.9 13.59,174.9 Screen.1 ; 27.99,222.35 21.29,222.35 20.63,221.69 J1.2 7.02,218.49 J1.3
  Bottom Layer w0.254: U1.G3 5.21,218.17 J1.3
TPWR: length 27.1
  Top Layer w0.254: 21.29,220.35 21.29,219.56 U1.VIN

## Text on the board
Document Layer: MOARkNOBS-42
Top Silkscreen Layer: MAIN | f1 | f2 | brain | PWR | MOAR k NOBS - 42 | v1.04 | MIDI OUT | 1x2 | 1x1 | MIDI IN | LED | EF1 | EF2 | EF3 | EF4 | EF5 | EF6 | 7x6 | \\  |  / / CNTRL / /  |  \\
